# Altium schematic sheet Power.SchDoc: =title_
size 594 x 420 mm; Date: 06/04/2023; CheckedBy: EG; GD; GK; MS; DrawnBy: M. Gąska; DocumentNumber: 2; SheetNumber: 2; SheetTotal: 5; Projet: DI/OT Crate; DivGrp: BE-CO; Title2: Power; Designer: G.Daniluk; CreateDate: 06/04/2023; CheckedDate: 06/04/2023
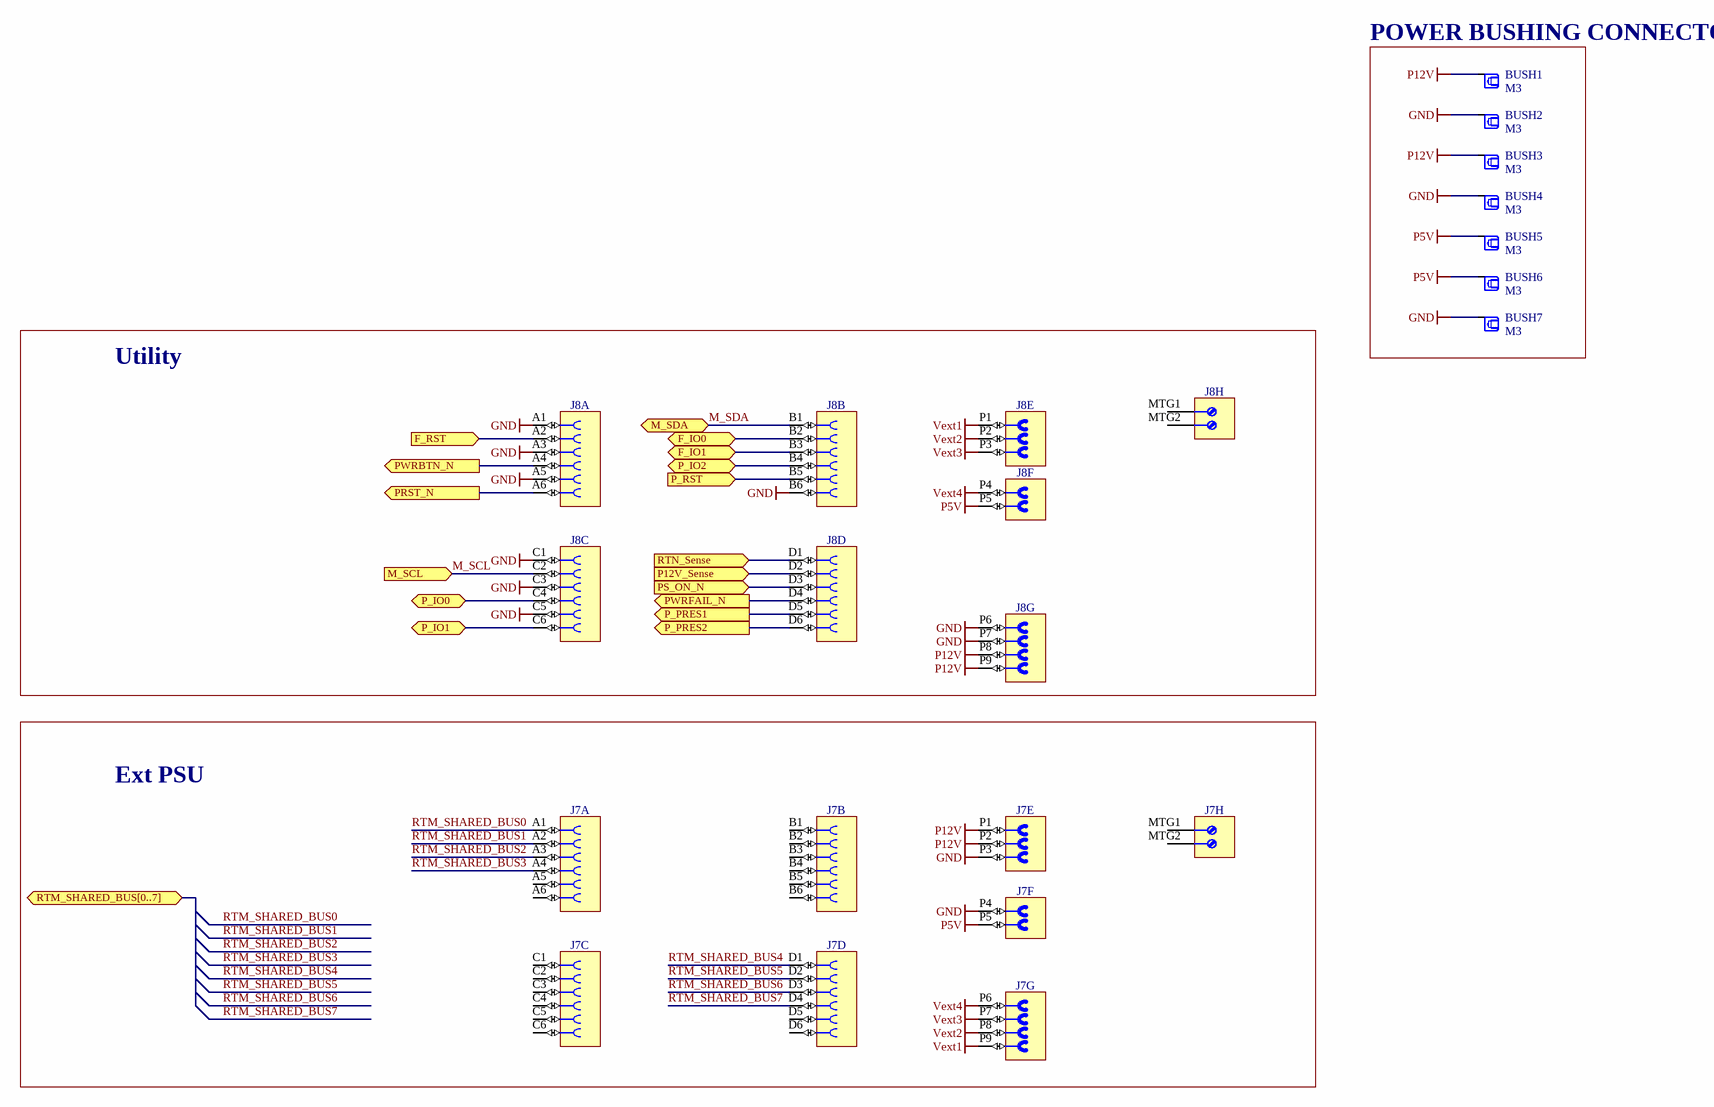
[diagram p0: Power.SchDoc]

## Parts
BUSH1  M3  [WURTH_7461057]
BUSH2  M3  [WURTH_7461057]
BUSH3  M3  [WURTH_7461057]
BUSH4  M3  [WURTH_7461057]
BUSH5  M3  [WURTH_7461057]
BUSH6  M3  [WURTH_7461057]
BUSH7  M3  [WURTH_7461057]
J7  PwrBlade  [AMPHENOL_51940-650]  (value not drawn)  (parts A,B,C,D,E,F,G,H of 8)
J8  PwrBlade  [AMPHENOL_51940-650]  (value not drawn)  (parts A,B,C,D,E,F,G,H of 8)

## Blocks framed on the sheet
POWER BUSHING CONNECTORS: BUSH1-BUSH7
Utility: J8
Ext PSU: J7

## Ports
F_IO0 (bidir), F_IO1 (bidir), F_RST (in), M_SCL (in), M_SDA (bidir), P12V_Sense (in), P_IO0 (bidir), P_IO1 (bidir), P_IO2 (bidir), P_PRES1 (out), P_PRES2 (out), P_RST (in), PRST_N (out), PS_ON_N (in), PWRBTN_N (out), PWRFAIL_N (out), RTM_SHARED_BUS[0..7] (bidir), RTN_Sense (in)

## Nets
GND: BUSH2.1 BUSH4.1 BUSH7.1 J7.P3 J7.P4 J8.A1 J8.A3 J8.A5 J8.B6 J8.C1 J8.C3 J8.C5 J8.P6 J8.P7
P5V: BUSH5.1 BUSH6.1 J7.P5 J8.P5
P12V: BUSH1.1 BUSH3.1 J7.P1 J7.P2 J8.P8 J8.P9
Vext1: J7.P9 J8.P1
Vext2: J7.P8 J8.P2
Vext3: J7.P7 J8.P3
Vext4: J7.P6 J8.P4
F_IO0: J8.B2 ; port F_IO0
F_IO1: J8.B3 ; port F_IO1
F_RST: J8.A2 ; port F_RST
M_SCL: J8.C2 ; port M_SCL
M_SDA: J8.B1 ; port M_SDA
P12V_Sense: J8.D2 ; port P12V_Sense
P_IO0: J8.C4 ; port P_IO0
P_IO1: J8.C6 ; port P_IO1
P_IO2: J8.B4 ; port P_IO2
P_PRES1: J8.D5 ; port P_PRES1
P_PRES2: J8.D6 ; port P_PRES2
P_RST: J8.B5 ; port P_RST
PRST_N: J8.A6 ; port PRST_N
PS_ON_N: J8.D3 ; port PS_ON_N
PWRBTN_N: J8.A4 ; port PWRBTN_N
PWRFAIL_N: J8.D4 ; port PWRFAIL_N
RTM_SHARED_BUS0: J7.A1
RTM_SHARED_BUS1: J7.A2
RTM_SHARED_BUS2: J7.A3
RTM_SHARED_BUS3: J7.A4
RTM_SHARED_BUS4: J7.D1
RTM_SHARED_BUS5: J7.D2
RTM_SHARED_BUS6: J7.D3
RTM_SHARED_BUS7: J7.D4
RTN_Sense: J8.D1 ; port RTN_Sense

Not connected (* = marked no-connect by the designer): J7 A5 A6 B1 B2 B3 B4 B5 B6 C1 C2 C3 C4 C5 C6 D5 D6 MTG1 MTG2; J8 MTG1 MTG2

## Notes on the sheet
- Project/Equipment
- Document
- File
- Designer
- Drawn by
- Check.by
- Last Mod.
- Copyright WUT ISE 2024.
  This documentation describes Open Hardware and is licensed under the CERN OHL-W v.2.0. You may redistribute and modify this documentation under the terms of the CERN OHL-W v.2.0. (http://ohwr.org/CERNOHL). This documentation is distributed WITHOUT ANY EXPRESS OR IMPLIED WARRANTY, INCLUDING OF MERCHANTABILITY, SATISFACTORY QUALITY AND FITNESS FOR A PARTICULAR PURPOSE. Please see the CERN OHL v.2.0 for applicable conditions.
- Contact
- Print Date
- Sheet
- Size
- A2
- of
- Rev

## Library data of the parts
BUSH1-BUSH7 = WURTH_7461057: Bush; Part Description: REDCUBE Bush with Threaded Hole M3 and Two Rows Press-Fit Pin-Plate, WP-BUTR Series; Manufacturer: WURTH; Part Number: WURTH_7461057; Component Kind: Standard; Component Type: Standard; Pin Count: 6; PackageDescription: 7x7x6mm REDCUBE Press-Fit with Internsl Threaded Hole M3,Two Rows Pin-Plate WP-BUTR; Mounted: Yes; Socket: No; SMD: No; PressFit: Yes; Sense: No; Status: None; Value: M3; Manufacturer Part Number: 7461057; ComponentHeight: 6mm; HelpURL: \\cern.ch\dfs\Applications\Altium\Datasheets\WURTH_7461057.pdf; Author: CERN DEM JLC; CreateDate: 13.08.2018; LatestRevisionDate: 13.08.2018
J7 J8 = AMPHENOL_51940-650: Thru-Hole, Lead 3.43mm, PowerBlade Vertical Power Connector 3ACP 2P 24S 4DCP Contacts; Part Description: Vertical PowerBlade Power Connector 3ACP + 2P + 24S + 4DCP PressFit Contacts; Part Number: AMPHENOL_51940-650; Component Kind: Standard; Component Type: Standard; Pin Count: 28; Family: PwrBlade; Mounted: Yes; Socket: No; SMD: No; PressFit: Yes; Sense: No; Status: None; Manufacturer: AMPHENOL; Manufacturer Part Number: 51940-650; ComponentHeight: 12.7mm; HelpURL: \\cern.ch\dfs\Applications\Altium\Datasheets\AMPHENOL_51940-650.pdf; Author: CERN DEM HF
  J7: CreateDate: 13.12.2022; LatestRevisionDate: 13.12.2022
  J8: CreateDate: 13/12/2022; LatestRevisionDate: 13/12/2022